# Altium schematic sheet [4]ADC&Filter.SchDoc: ADC&Filter
size A3; Organization: Altium Limited; Address1: SPARC Lab; Address2: SEEE-HUST; Address3: Dai Co Viet, Ha Noi; DocumentNumber: 4; SheetNumber: 4; SheetTotal: 5
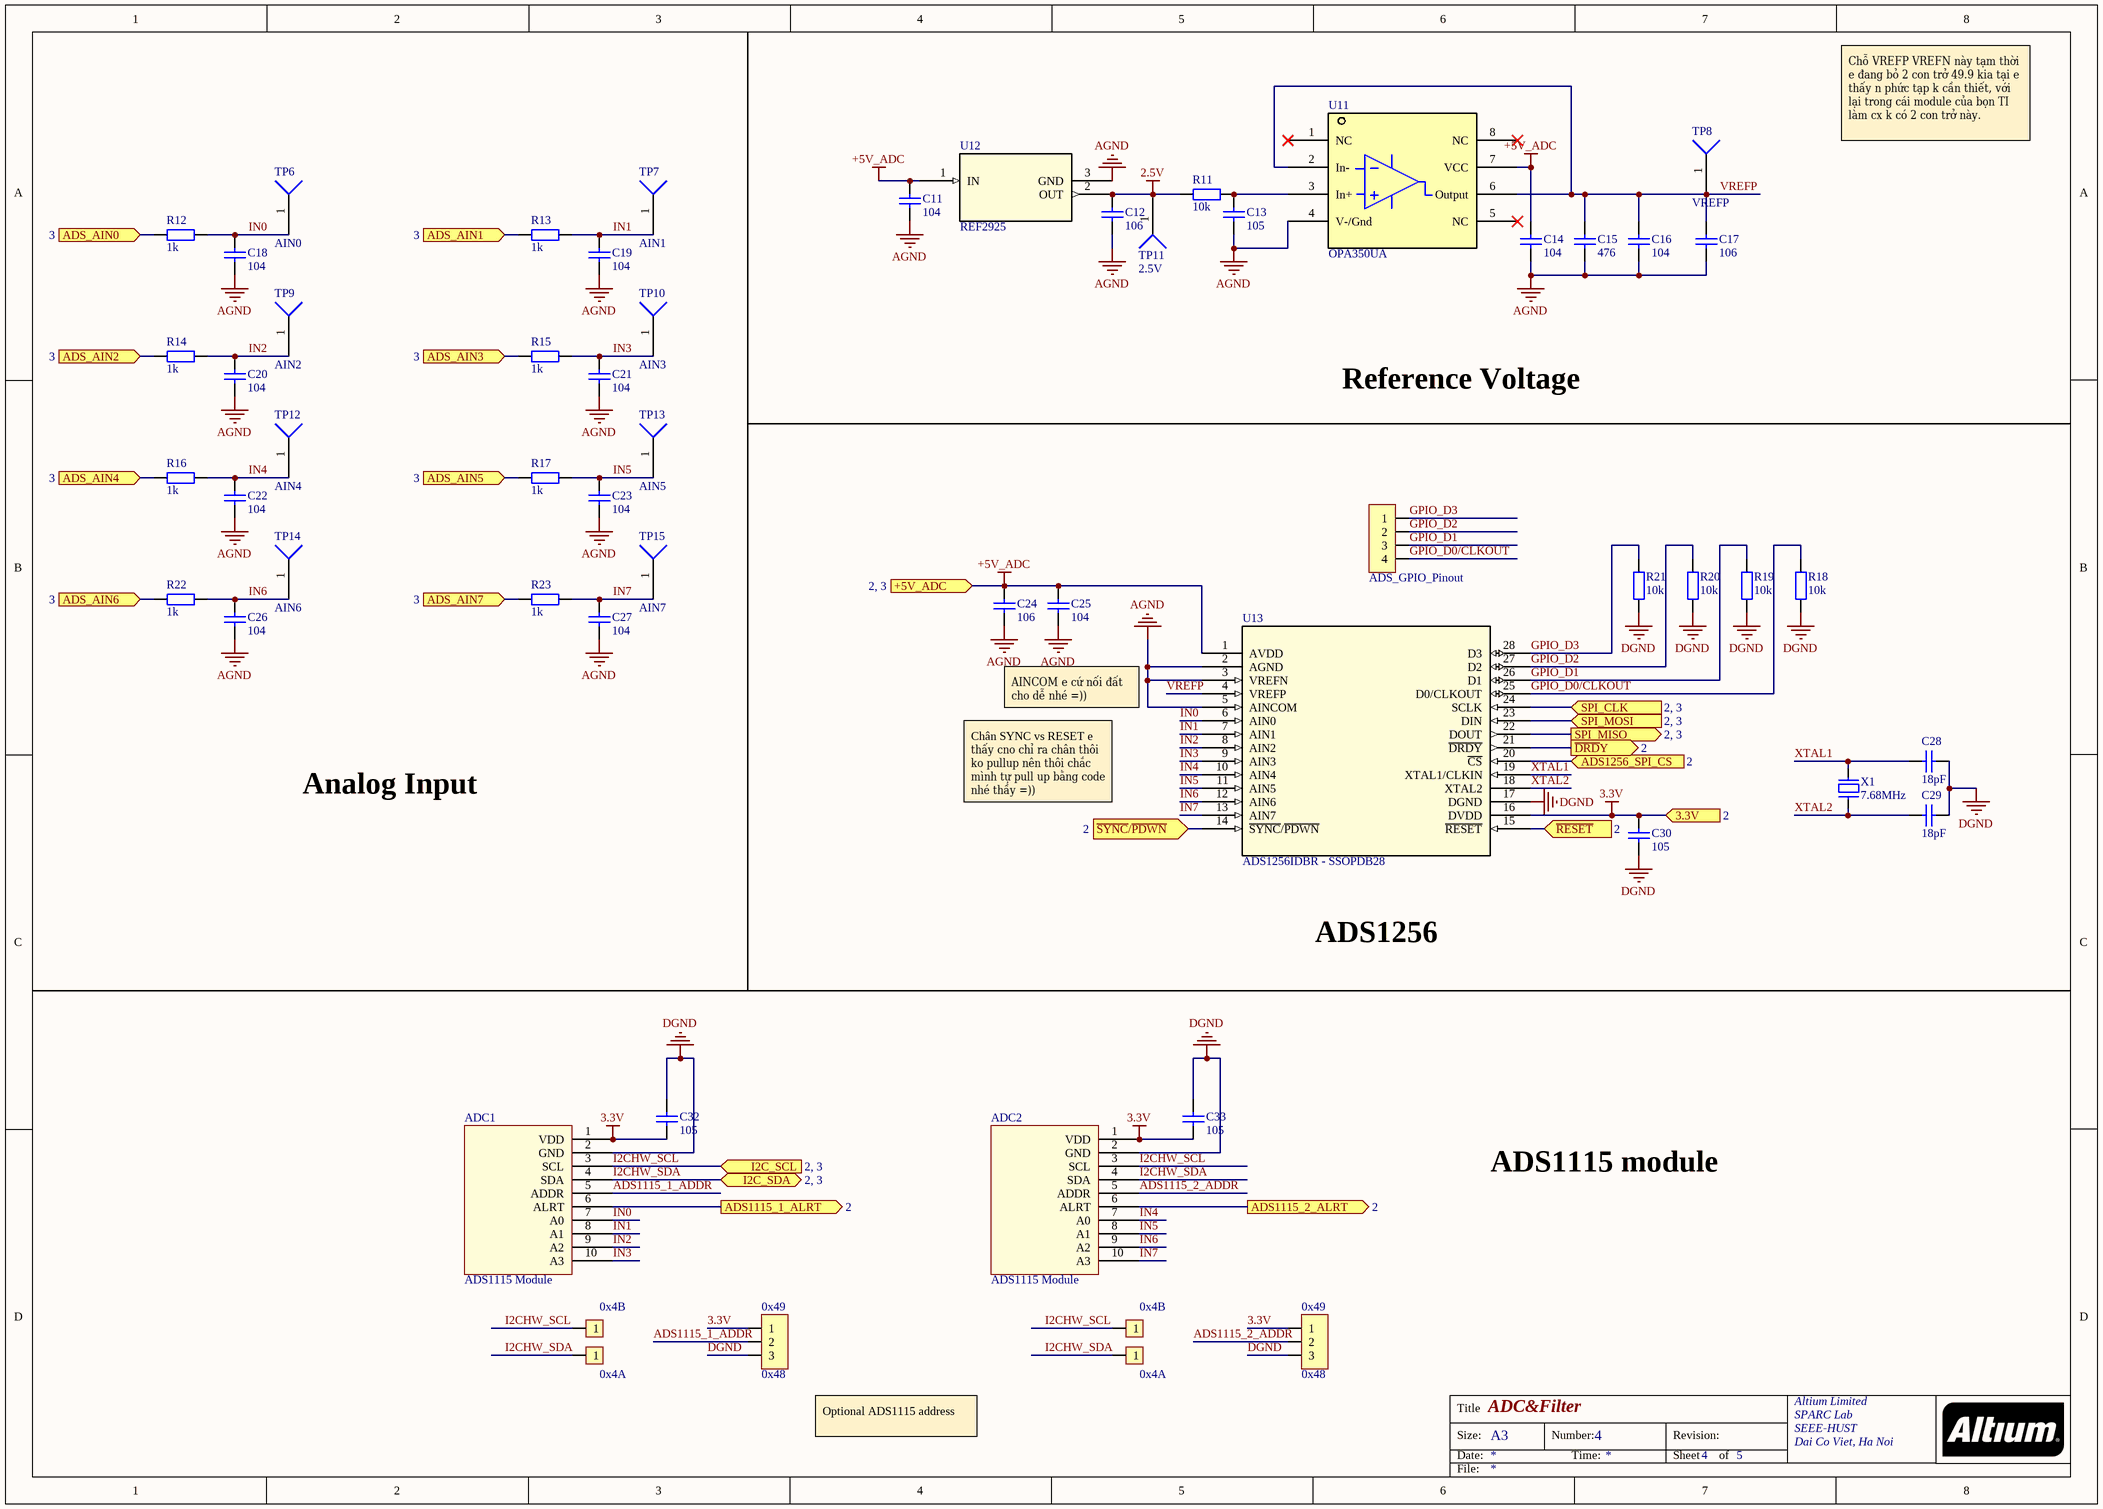
[diagram p0: [4]ADC&Filter.SchDoc]

## Parts
ADC1  ADS1115 Module  [ADS1115]
ADC2  ADS1115 Module  [ADS1115]
C11  104  [tu 0805]
C12  106  [tu 0805]
C13  105  [tu 0805]
C14  104  [tu 0805]
C15  476  [tu 0805]
C16  104  [tu 0805]
C17  106  [tu 0805]
C18  104  [tu 0805]
C19  104  [tu 0805]
C20  104  [tu 0805]
C21  104  [tu 0805]
C22  104  [tu 0805]
C23  104  [tu 0805]
C24  106  [tu 0805]
C25  104  [tu 0805]
C26  104  [tu 0805]
C27  104  [tu 0805]
C28  18pF  [tu 0805]
C29  18pF  [tu 0805]
C30  105  [tu 0805]
C32  105  [tu 0805]
C33  105  [tu 0805]
JP1  ADS_GPIO_Pinout  [JP 1x4 DT]
JP5  JP 1x3 2.54  [JP 1x3 DT]  (value not drawn)
JP6  JP 1x3 2.54  [JP 1x3 DT]  (value not drawn)
JP7  JP 1x1 2.54  [JP 1x1 DT]  (value not drawn)
JP8  JP 1x1 2.54  [JP 1x1 DT]  (value not drawn)
JP9  JP 1x1 2.54  [JP 1x1 DT]  (value not drawn)
JP10  JP 1x1 2.54  [JP 1x1 DT]  (value not drawn)
R11  10k  [tro smd 0805]
R12  1k  [tro smd 0805]
R13  1k  [tro smd 0805]
R14  1k  [tro smd 0805]
R15  1k  [tro smd 0805]
R16  1k  [tro smd 0805]
R17  1k  [tro smd 0805]
R18  10k  [tro smd 0805]
R19  10k  [tro smd 0805]
R20  10k  [tro smd 0805]
R21  10k  [tro smd 0805]
R22  1k  [tro smd 0805]
R23  1k  [tro smd 0805]
TP6  AIN0  [pad_1.65x1.65_hole_1mm]
TP7  AIN1  [pad_1.65x1.65_hole_1mm]
TP8  VREFP  [pad_1.65x1.65_hole_1mm]
TP9  AIN2  [pad_1.65x1.65_hole_1mm]
TP10  AIN3  [pad_1.65x1.65_hole_1mm]
TP11  2.5V  [pad_1.65x1.65_hole_1mm]
TP12  AIN4  [pad_1.65x1.65_hole_1mm]
TP13  AIN5  [pad_1.65x1.65_hole_1mm]
TP14  AIN6  [pad_1.65x1.65_hole_1mm]
TP15  AIN7  [pad_1.65x1.65_hole_1mm]
U11  OPA350UA  [SOIC 8_127P599X175]
U12  REF2925  [SOT23-DBZ3]
U13  ADS1256IDBR - SSOPDB28  [SSOPDB28]
X1  7.68MHz  [Thach Anh 2 chan SMD]

## Ports
3.3V (in, see 2), +5V_ADC (in, see 2, 3), ADS1115_1_ALRT (out, see 2), ADS1115_2_ALRT (out, see 2), ADS1256_SPI_CS (in, see 2), ADS_AIN0 (in, see 3), ADS_AIN1 (in, see 3), ADS_AIN2 (in, see 3), ADS_AIN3 (in, see 3), ADS_AIN4 (in, see 3), ADS_AIN5 (in, see 3), ADS_AIN6 (in, see 3), ADS_AIN7 (in, see 3), I2C_SCL (in, see 2, 3), I2C_SDA (bidir, see 2, 3), SPI_CLK (in, see 2, 3), SPI_MISO (out, see 2, 3), SPI_MOSI (in, see 2, 3), ~{DRD}Y (out, see 2), ~{RESET} (in, see 2), ~{SYNC}/~{PDWN} (in, see 2)

## Nets
2.5V: C12.1 R11.1 TP11.1 U12.2(OUT)
3.3V: ADC1.1(VDD) ADC2.1(VDD) C30.1 C32.1 C33.1 JP5.1 JP6.1 U13.16(DVDD) ; port 3.3V
+5V_ADC: C11.1 C14.1 C24.1 C25.1 U11.7(VCC) U12.1(IN) U13.1(AVDD) ; port +5V_ADC
AGND: C11.2 C12.2 C13.2 C14.2 C15.2 C16.2 C17.2 C18.2 C19.2 C20.2 C21.2 C22.2 C23.2 C24.2 C25.2 C26.2 C27.2 U11.4(V-/Gnd) U12.3(GND) U13.2(AGND) U13.3(VREFN) U13.5(AINCOM)
DGND: ADC1.2(GND) ADC2.2(GND) C28.1 C29.1 C30.2 C32.2 C33.2 JP5.3 JP6.3 R18.1 R19.2 R20.2 R21.2 U13.17(DGND)
ADS1115_1_ADDR: ADC1.5(ADDR) JP5.2
ADS1115_1_ALRT: ADC1.6(ALRT) ; port ADS1115_1_ALRT
ADS1115_2_ADDR: ADC2.5(ADDR) JP6.2
ADS1115_2_ALRT: ADC2.6(ALRT) ; port ADS1115_2_ALRT
ADS1256_SPI_CS: U13.20(~{CS}) ; port ADS1256_SPI_CS
ADS_AIN0: R12.1 ; port ADS_AIN0
ADS_AIN1: R13.1 ; port ADS_AIN1
ADS_AIN2: R14.1 ; port ADS_AIN2
ADS_AIN3: R15.1 ; port ADS_AIN3
ADS_AIN4: R16.1 ; port ADS_AIN4
ADS_AIN5: R17.1 ; port ADS_AIN5
ADS_AIN6: R22.1 ; port ADS_AIN6
ADS_AIN7: R23.1 ; port ADS_AIN7
~{DRD}Y: U13.21(~{DRDY}) ; port ~{DRD}Y
GPIO_D0/CLKOUT: JP1.4 R18.2 U13.25(D0/CLKOUT)
GPIO_D1: JP1.3 R19.1 U13.26(D1)
GPIO_D2: JP1.2 R20.1 U13.27(D2)
GPIO_D3: JP1.1 R21.1 U13.28(D3)
I2CHW_SCL: ADC1.3(SCL) ADC2.3(SCL) JP7.1 JP8.1 ; port I2C_SCL
I2CHW_SDA: ADC1.4(SDA) ADC2.4(SDA) JP9.1 JP10.1 ; port I2C_SDA
IN0: ADC1.7(A0) C18.1 R12.2 TP6.1 U13.6(AIN0)
IN1: ADC1.8(A1) C19.1 R13.2 TP7.1 U13.7(AIN1)
IN2: ADC1.9(A2) C20.1 R14.2 TP9.1 U13.8(AIN2)
IN3: ADC1.10(A3) C21.1 R15.2 TP10.1 U13.9(AIN3)
IN4: ADC2.7(A0) C22.1 R16.2 TP12.1 U13.10(AIN4)
IN5: ADC2.8(A1) C23.1 R17.2 TP13.1 U13.11(AIN5)
IN6: ADC2.9(A2) C26.1 R22.2 TP14.1 U13.12(AIN6)
IN7: ADC2.10(A3) C27.1 R23.2 TP15.1 U13.13(AIN7)
~{RESET}: U13.15(~{RESET}) ; port ~{RESET}
~{SYNC}/~{PDWN}: U13.14(~{SYNC}/~{PDWN}) ; port ~{SYNC}/~{PDWN}
SPI_CLK: U13.24(SCLK) ; port SPI_CLK
SPI_MISO: U13.22(DOUT) ; port SPI_MISO
SPI_MOSI: U13.23(DIN) ; port SPI_MOSI
VREFP: C15.1 C16.1 C17.1 TP8.1 U11.2(In-) U11.6(Output) U13.4(VREFP)
XTAL1: C28.2 U13.19(XTAL1/CLKIN) X1.2
XTAL2: C29.2 U13.18(XTAL2) X1.1
NetC13_1: C13.1 R11.2 U11.3(In+)

Not connected (* = marked no-connect by the designer): U11 1(NC)* 5(NC)* 8(NC)*

## Notes on the sheet
- Chỗ VREFP VREFN này tạm thời e đang bỏ 2 con trở 49.9 kia tại e thấy n phức tạp k cần thiết, với lại trong cái module của bọn TI làm cx k có 2 con trở này.
- Reference Voltage
- AINCOM e cứ nối đất cho dễ nhé =))
- Analog Input
- Chân SYNC vs RESET e thấy cno chỉ ra chân thôi ko pullup nên thôi chắc mình tự pull up bằng code nhé thầy =))
- ADS1256
- ADS1115 module
- (near JP7) 0x4B
- (near JP5) 0x49
- (near JP8) 0x4B
- (near JP6) 0x49
- (near JP9) 0x4A
- (near JP5) 0x48
- (near JP10) 0x4A
- (near JP6) 0x48
- Optional ADS1115 address
- Title
- Size:
- Date:
- A3
- Number:
- Time:
- Revision:
- Sheet
- of
- File:

## Library data of the parts
ADC1 ADC2 = ADS1115 Module ADC
C11 C14 C16 C18-C23 C25-C27 = Tu 0805 104 50V 10%: Dán; Don_Vi: Con; So_Chan: 2; Ten_Linh_Kien: Tụ 0805 104-100nF 10% 50V; Ma_Hang: MH004551; Chung_Loai: Dán; Kieu_Chan: *
C12 C17 C24 = Tu 0805 106 16V 10%: Dán; Ten_Linh_Kien: Tụ 0805 106-10uF 10% 16V; So_Chan: 2; Don_Vi: Con; Ma_Hang: MH004553; Chung_Loai: Dán; Kieu_Chan: *
C13 C30 C32 C33 = Tu 0805 105 50V 10%: Dán; Don_Vi: Con; So_Chan: 2; Ten_Linh_Kien: Tụ 0805 105-1uF 10% 50V; Ma_Hang: MH004552; Chung_Loai: Dán; Kieu_Chan: *
C15 = Tu 0805 475 25V 20%: Dán; Don_Vi: Con; So_Chan: 2; Ten_Linh_Kien: Tụ 0805 475-4.7uF 20% 25V; Ma_Hang: MH004276; Chung_Loai: Dán; Kieu_Chan: *
C28 C29 = Tu 0805 18pF 50V 10%_1: Dán; Don_Vi: Con; Ten_Linh_Kien: Tụ 0805 20P 10% 50V; So_Chan: 2; Ma_Hang: MH004558; Chung_Loai: Dán; Kieu_Chan: *
JP1 = JP 1x4 2.54 Duc Thang: Cắm; Ten_Linh_Kien: Jump Đơn Đực 2.54MM 1x40P Thẳng 11MM; Don_Vi: Con; Ma_Hang: MH000903; Ghi_Chu: *; Kieu_Chan: *; Chung_Loai: Cắm
JP5 JP6 = JP 1x3 2.54 Duc Thang: Cắm; Ten_Linh_Kien: Jump Đơn Đực 2.54MM 1x40P Thẳng 11MM; Don_Vi: Con; Ma_Hang: MH000903; Ghi_Chu: *; Kieu_Chan: *; Chung_Loai: Cắm
JP7-JP10 = JP 1x1 2.54 Duc Thang: Cắm; Ten_Linh_Kien: Jump Đơn Đực 2.54MM 1x40P Thẳng 11MM; Don_Vi: Con; Ma_Hang: MH000903; Ghi_Chu: *; Kieu_Chan: *; Chung_Loai: Cắm
R11 R18-R21 = Tro 0805 1% 10k: Dán; Don_Vi: Con; So_Chan: 2; Ten_Linh_Kien: Trở 0805 1% 10k; Ma_Hang: MH005473; Chung_Loai: Dán; Kieu_Chan: *
R12-R17 R22 R23 = Tro 0805 1% 1k: Dán; Don_Vi: Con; So_Chan: 2; Ten_Linh_Kien: Trở 0805 1% 1k; Ma_Hang: MH005468; Chung_Loai: Dán; Kieu_Chan: *
TP6-TP15 = Test Point: Ports: 1; Positions/Loaded: Port1 - 4/2; PerformanceCategory: 3; PCB_Mounting: Thru-Hole; PCB_Thickness: 0.125"; DrillSize: Nominal, Rounded to nearest 0.05mm; PCB_Layout: Complies with Manufacturer's Recommendation.; Published: 25-Jun-2002; DatasheetDocument: 20-Nov-2001; PackageDocument: 20-Nov-2001; PackageReference: 42878-4410; Publisher: Altium Limited; ComponentLink1Description: Manufacturer Link; ComponentLink1URL: http://www.molex.com/; ComponentLink2Description: Datasheet; ComponentLink2URL: http://www.molex.com/cmc_upload/common_files/1212003_42878catalogpage.pdf
U11 = OPA350: Op-amp OPA350
U12 = REF2925AIDBZR: SOT-23 CMOS 2.5V Voltage Reference; Mfr_Name: Texas Instruments; RefDes: RefDes; Type: Type
U13 = ADS1256IDBR - SSOPDB28: Very Low Noise, 24-Bit Analog-to-Digital Converter; Mfr_Name: Texas Instruments; RefDes: RefDes; Type: Type
X1 = Thach Anh 2 chan SMD: Crystal For all Crystal 2pin.; Value: 4Mhz